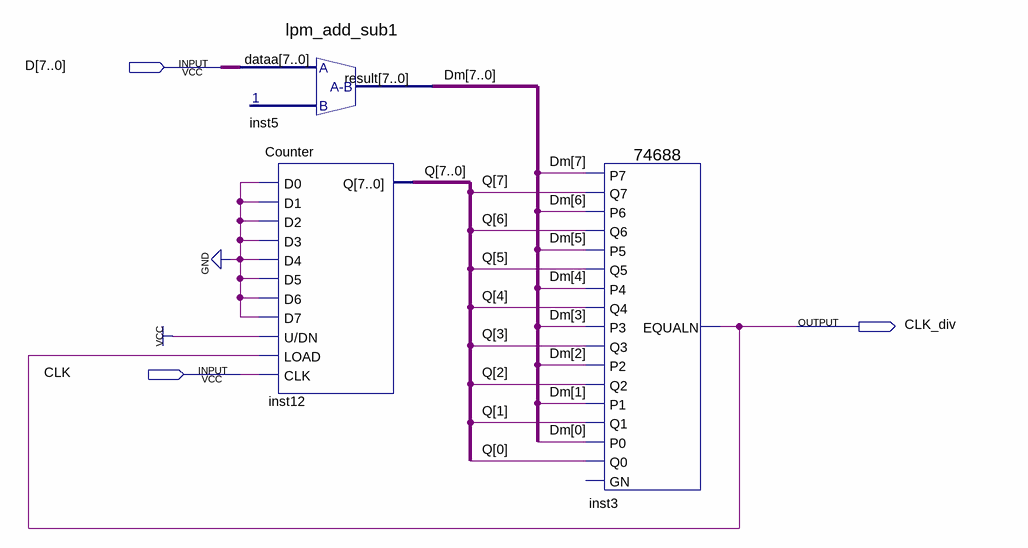
[diagram p0: schematic sheet]
// Quartus schematic divider.bdf as structural Verilog: 3 symbols, 3 pins
module divider (
  input  [7:0] D,
  input  CLK,
  output CLK_div
);

  wire [7:0] Dm, Q;

  lpm_add_sub1 inst5 (.dataa(D), .result(Dm));
  Counter inst12 (
    .D0(1'b0), .D1(1'b0), .D2(1'b0), .D3(1'b0), .D4(1'b0), .D5(1'b0), .D6(1'b0), .D7(1'b0), .\U/DN (1'b1),
    .LOAD(CLK_div), .CLK(CLK), .Q(Q));
  \74688  inst3 (
    .P6(Dm[6]), .Q3(Q[3]), .P3(Dm[3]), .Q4(Q[4]), .P4(Dm[4]), .Q2(Q[2]), .P1(Dm[1]), .Q1(Q[1]), .P0(Dm[0]),
    .Q0(Q[0]), .P2(Dm[2]), .Q7(Q[7]), .Q5(Q[5]), .P5(Dm[5]), .Q6(Q[6]), .P7(Dm[7]), .EQUALN(CLK_div));  // open: GN
endmodule
